# EAGLE design TLC591x-Interface-Board (EAGLE 9.0.0)
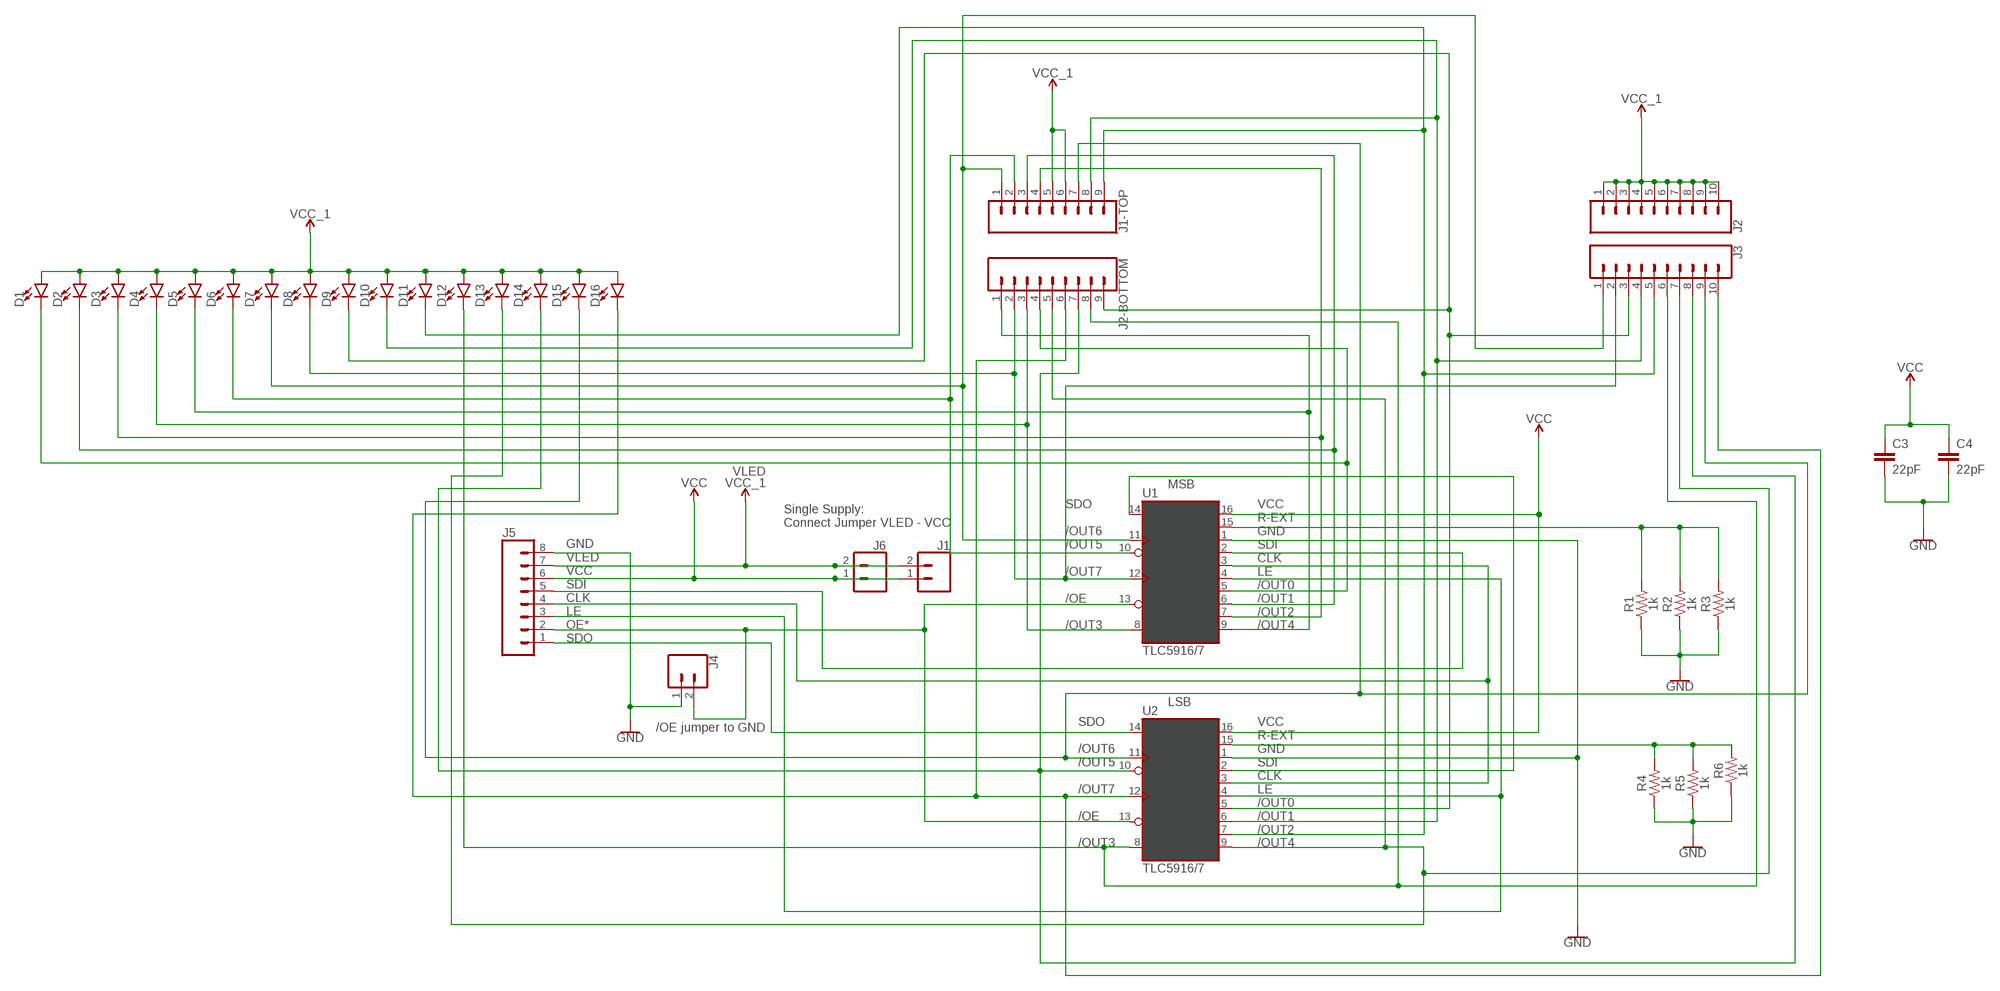
[diagram p0: schematic, sheet 1]

## Parts
C3  22pF  22PF-PTH-2.54MM-200V-5%  [CAP-PTH-2.54]
C4  22pF  22PF-PTH-2.54MM-200V-5%  [CAP-PTH-2.54]
D1  LED3MM  [LED_3MM]
D2  LED3MM  [LED_3MM]
D3  LED3MM  [LED_3MM]
D4  LED3MM  [LED_3MM]
D5  LED3MM  [LED_3MM]
D6  LED3MM  [LED_3MM]
D7  LED3MM  [LED_3MM]
D8  LED3MM  [LED_3MM]
D9  LED3MM  [LED_3MM]
D10  LED3MM  [LED_3MM]
D11  LED3MM  [LED_3MM]
D12  LED3MM  [LED_3MM]
D13  LED3MM  [LED_3MM]
D14  LED3MM  [LED_3MM]
D15  LED3MM  [LED_3MM]
D16  LED3MM  [LED_3MM]
J1  CONN_02  [1X02]
J1-TOP  CONN_09  [1X09]
J2  CONN_10LOCK  [1X10_LOCK]
J2-BOTTOM  CONN_09  [1X09]
J3  CONN_10LOCK  [1X10_LOCK]
J4  CONN_02  [1X02]
J5  CONN_08LOCK  [1X08_LOCK]
J6  CONN_02  [1X02]
R1  1k  1KOHM-HORIZ-1/4W-1%  [AXIAL-0.3]
R2  1k  1KOHM-HORIZ-1/4W-1%  [AXIAL-0.3]
R3  1k  1KOHM-HORIZ-1/4W-1%  [AXIAL-0.3]
R4  1k  1KOHM-HORIZ-1/4W-1%  [AXIAL-0.3]
R5  1k  1KOHM-HORIZ-1/4W-1%  [AXIAL-0.3]
R6  1k  1KOHM-HORIZ-1/4W-1%  [AXIAL-0.3]
U1  TLC5916/7  74HC595N  [DIP16]
U2  TLC5916/7  74HC595N  [DIP16]

## Nets
GND: C3.2 C4.2 J4.1 J5.8 R1.P$1 R2.P$1 R3.P$1 R4.P$1 R5.P$1 R6.P$1 U1.1(QB) U2.1(QB)
N$1: J4.2 J5.2 U1.13(G) U2.13(G)
N$2: J5.1 U2.14(SER)
N$3: D15.K(C) J1-TOP.7 J3.9 U2.11(SCK)
N$5: D7.K(C) J1-TOP.1 J3.1 U1.11(SCK)
N$6: D6.K(C) J1-TOP.2 U1.10(SCL)
N$7: D5.K(C) J2-BOTTOM.1 U1.9(QH*)
N$8: D4.K(C) J2-BOTTOM.3 U1.8(GND)
N$9: D3.K(C) J1-TOP.4 U1.7(QH)
N$10: D2.K(C) J1-TOP.3 U1.6(QG)
N$11: D1.K(C) J2-BOTTOM.4 U1.5(QF)
N$12: D16.K(C) J2-BOTTOM.6 J3.10 U2.12(RCK)
N$13: D14.K(C) J2-BOTTOM.7 J3.8 U2.10(SCL)
N$14: D13.K(C) J2-BOTTOM.5 J3.7 U2.9(QH*)
N$15: D12.K(C) J2-BOTTOM.8 J3.6 U2.8(GND)
N$16: D11.K(C) J1-TOP.9 J3.5 U2.7(QH)
N$17: D10.K(C) J1-TOP.8 J3.4 U2.6(QG)
N$18: D9.K(C) J2-BOTTOM.9 J3.3 U2.5(QF)
N$19: R1.P$2 R2.P$2 R3.P$2 U1.15(QA)
N$20: U1.14(SER) U2.2(QC)
N$21: R4.P$2 R5.P$2 R6.P$2 U2.15(QA)
N$22: J5.5 U1.2(QC)
N$24: J5.4 U1.3(QD) U2.3(QD)
N$25: J5.3 U1.4(QE) U2.4(QE)
N$26: D8.K(C) J2-BOTTOM.2 J3.2 U1.12(RCK)
VCC: C3.1 C4.1 J1.1 J5.6 J6.1 U1.16(VCC) U2.16(VCC)
VCC_1: D1.A D2.A D3.A D4.A D5.A D6.A D7.A D8.A D9.A D10.A D11.A D12.A D13.A D14.A D15.A D16.A J1-TOP.5 J1-TOP.6 J1.2 J2.1 J2.2 J2.3 J2.4 J2.5 J2.6 J2.7 J2.8 J2.9 J2.10 J5.7 J6.2

## Notes on the sheet
- VLED
- MSB
- Single Supply: 
  Connect Jumper VLED - VCC
- SDO
  
  /OUT6
  /OUT5
  
  /OUT7
  
  /OE
  
  /OUT3
- VCC
  R-EXT
  GND
  SDI
  CLK
  LE
  /OUT0
  /OUT1
  /OUT2
  /OUT4
- GND
  VLED
  VCC
  SDI
  CLK
  LE
  OE*
  SDO
- LSB
- /OE jumper to GND
- SDO
  
  /OUT6
  /OUT5
  
  /OUT7
  
  /OE
  
  /OUT3
- VCC
  R-EXT
  GND
  SDI
  CLK
  LE
  /OUT0
  /OUT1
  /OUT2
  /OUT4

## Library data of the parts
C3 C4 = SparkFun-Capacitors:22PF: 22pF ceramic capacitors A capacitor is a passive two-terminal electrical component used to store electrical energy temporarily in an electric field.; PROD_ID: CAP-09128
D1-D16 = SparkFun-LED:LED: LED (Generic) Standard schematic elements and footprints for 5mm, 3mm, 1206, and 0603 sized LEDs. Generic LEDs with no color specified.; PROD_ID: DIO-08794
J1 J4 J6 = SparkFun-Connectors:CONN_02: Multi connection point. Often used as Generic Header-pin footprint for 0.1 inch spaced/style header connections On any of the 0.1 inch spaced packages, you can populate with these: Break Away Headers - Straight <https://www.sparkfun.com/products/116> (PRT-00116) Break Away Male Headers - Right Angle <https://www.sparkfun.com/products/553> (PRT-00553) Female Headers <https://www.sparkfun.com/products/115> (PRT-00115) Break Away Headers - Machine Pin <https://www.sparkfun.com/products/117> (PRT-00117) Break Away Female Headers - Swiss Machine Pin <https://www.sparkfun.com/products/743> (PRT-00743) For SCREWTERMINALS and SPRING TERMINALS visit here: Screw Terimnals on SparkFun.com <https://www.sparkfun.com/search/results?term=Screw+Terminals> (5mm/3.5mm/2.54mm spacing) This device is also useful as a general connection point to wire up your design to another part of your project. Our various solder wires solder well into these plated through hole pads. Hook-Up Wire - Assortment (Stranded, 22 AWG) <https://www.sparkfun.com/products/11375> (PRT-11375) Hook-Up Wire - Assortment (Solid Core, 22 AWG) <https://www.sparkfun.com/products/11367> (PRT-11367) View the entire wire category on our website here <https://www.sparkfun.com/categories/141> Special notes: Molex polarized connector foot print use with: PRT-08233 with associated crimp pins and housings. 2.54_SCREWTERM for use with PRT-10571. 3.5mm Screw Terminal footprints for PRT-08084 5mm Screw Terminal footprints for use with PRT-08432
J1-TOP J2-BOTTOM = SparkFun-Connectors:CONN_09: Multi connection point. Often used as Generic Header-pin footprint for 0.1 inch spaced/style header connections On any of the 0.1 inch spaced packages, you can populate with these: Break Away Headers - Straight <https://www.sparkfun.com/products/116> (PRT-00116) Break Away Male Headers - Right Angle <https://www.sparkfun.com/products/553> (PRT-00553) Female Headers <https://www.sparkfun.com/products/115> (PRT-00115) Break Away Headers - Machine Pin <https://www.sparkfun.com/products/117> (PRT-00117) Break Away Female Headers - Swiss Machine Pin <https://www.sparkfun.com/products/743> (PRT-00743) For SCREWTERMINALS and SPRING TERMINALS visit here: Screw Terimnals on SparkFun.com <https://www.sparkfun.com/search/results?term=Screw+Terminals> (5mm/3.5mm/2.54mm spacing) This device is also useful as a general connection point to wire up your design to another part of your project. Our various solder wires solder well into these plated through hole pads. Hook-Up Wire - Assortment (Stranded, 22 AWG) <https://www.sparkfun.com/products/11375> (PRT-11375) Hook-Up Wire - Assortment (Solid Core, 22 AWG) <https://www.sparkfun.com/products/11367> (PRT-11367) View the entire wire category on our website here <https://www.sparkfun.com/categories/141> Special notes: Molex polarized connector foot print use with SKU : PRT-08231 with associated crimp pins and housings. 1MM SMD Version SKU: PRT-10208 NOTES ON THE VARIANTS LOCK and LOCK_LONGPADS... This footprint was designed to help hold the alignment of a through-hole component (i.e. 6-pin header) while soldering it into place. You may notice that each hole has been shifted either up or down by 0.005 of an inch from it's more standard position (which is a perfectly straight line). This slight alteration caused the pins (the squares in the middle) to touch the edges of the holes. Because they are alternating, it causes a "brace" to hold the component in place. 0.005 has proven to be the perfect amount of "off-center" position when using our standard breakaway headers. Although looks a little odd when you look at the bare footprint, once you have a header in there, the alteration is very hard to notice. Also,if you push a header all the way into place, it is covered up entirely on the bottom side.
J2 J3 = SparkFun-Connectors:CONN_10: Multi connection point. Often used as Generic Header-pin footprint for 0.1 inch spaced/style header connections On any of the 0.1 inch spaced packages, you can populate with these: Break Away Headers - Straight <https://www.sparkfun.com/products/116> (PRT-00116) Break Away Male Headers - Right Angle <https://www.sparkfun.com/products/553> (PRT-00553) Female Headers <https://www.sparkfun.com/products/115> (PRT-00115) Break Away Headers - Machine Pin <https://www.sparkfun.com/products/117> (PRT-00117) Break Away Female Headers - Swiss Machine Pin <https://www.sparkfun.com/products/743> (PRT-00743) Arduino Stackable Header - 10 Pin <https://www.sparkfun.com/products/11376> (PRT-11376) For SCREWTERMINALS and SPRING TERMINALS visit here: Screw Terimnals on SparkFun.com <https://www.sparkfun.com/search/results?term=Screw+Terminals> (5mm/3.5mm/2.54mm spacing) This device is also useful as a general connection point to wire up your design to another part of your project. Our various solder wires solder well into these plated through hole pads. Hook-Up Wire - Assortment (Stranded, 22 AWG) <https://www.sparkfun.com/products/11375> (PRT-11375) Hook-Up Wire - Assortment (Solid Core, 22 AWG) <https://www.sparkfun.com/products/11367> (PRT-11367) View the entire wire category on our website here <https://www.sparkfun.com/categories/141> Special notes: Molex polarized connector foot print use with SKU : PRT-08231 with associated crimp pins and housings. 1MM SMD Version SKU: PRT-10208 NOTES ON THE VARIANTS LOCK and LOCK_LONGPADS... This footprint was designed to help hold the alignment of a through-hole component (i.e. 6-pin header) while soldering it into place. You may notice that each hole has been shifted either up or down by 0.005 of an inch from it's more standard position (which is a perfectly straight line). This slight alteration caused the pins (the squares in the middle) to touch the edges of the holes. Because they are alternating, it causes a "brace" to hold the component in place. 0.005 has proven to be the perfect amount of "off-center" position when using our standard breakaway headers. Although looks a little odd when you look at the bare footprint, once you have a header in there, the alteration is very hard to notice. Also,if you push a header all the way into place, it is covered up entirely on the bottom side.
J5 = SparkFun-Connectors:CONN_08: Multi connection point. Often used as Generic Header-pin footprint for 0.1 inch spaced/style header connections On any of the 0.1 inch spaced packages, you can populate with these: Break Away Headers - Straight <https://www.sparkfun.com/products/116> (PRT-00116) Break Away Male Headers - Right Angle <https://www.sparkfun.com/products/553> (PRT-00553) Female Headers <https://www.sparkfun.com/products/115> (PRT-00115) Break Away Headers - Machine Pin <https://www.sparkfun.com/products/117> (PRT-00117) Break Away Female Headers - Swiss Machine Pin <https://www.sparkfun.com/products/743> (PRT-00743) Arduino Stackable Header - 8 Pin <https://www.sparkfun.com/products/9279> (PRT-09279) For SCREWTERMINALS and SPRING TERMINALS visit here: Screw Terimnals on SparkFun.com <https://www.sparkfun.com/search/results?term=Screw+Terminals> (5mm/3.5mm/2.54mm spacing) This device is also useful as a general connection point to wire up your design to another part of your project. Our various solder wires solder well into these plated through hole pads. Hook-Up Wire - Assortment (Stranded, 22 AWG) <https://www.sparkfun.com/products/11375> (PRT-11375) Hook-Up Wire - Assortment (Solid Core, 22 AWG) <https://www.sparkfun.com/products/11367> (PRT-11367) View the entire wire category on our website here <https://www.sparkfun.com/categories/141> Special notes: Molex polarized connector foot print use with SKU : PRT-08231 with associated crimp pins and housings. 1MM SMD Version SKU: PRT-10208 NOTES ON THE VARIANTS LOCK and LOCK_LONGPADS... This footprint was designed to help hold the alignment of a through-hole component (i.e. 6-pin header) while soldering it into place. You may notice that each hole has been shifted either up or down by 0.005 of an inch from it's more standard position (which is a perfectly straight line). This slight alteration caused the pins (the squares in the middle) to touch the edges of the holes. Because they are alternating, it causes a "brace" to hold the component in place. 0.005 has proven to be the perfect amount of "off-center" position when using our standard breakaway headers. Although looks a little odd when you look at the bare footprint, once you have a header in there, the alteration is very hard to notice. Also,if you push a header all the way into place, it is covered up entirely on the bottom side.
R1-R6 = SparkFun-Resistors:1KOHM: 1kΩ resistor A resistor is a passive two-terminal electrical component that implements electrical resistance as a circuit element. Resistors act to reduce current flow, and, at the same time, act to lower voltage levels within circuits. - Wikipedia; PROD_ID: RES-12182
U1 U2 = SparkFun-IC-Logic:74*595: 8-Bit Shift Register (Serial to Parallel) Datasheet <http://cdn.sparkfun.com/datasheets/BreakoutBoards/MM74HC595.pdf> SparkFun Products SparkFun Shift Register Breakout - 74HC595 <https://www.sparkfun.com/products/10680> (BOB-10680); PROD_ID: IC-13123; VALUE: SN74HC595N

## Board
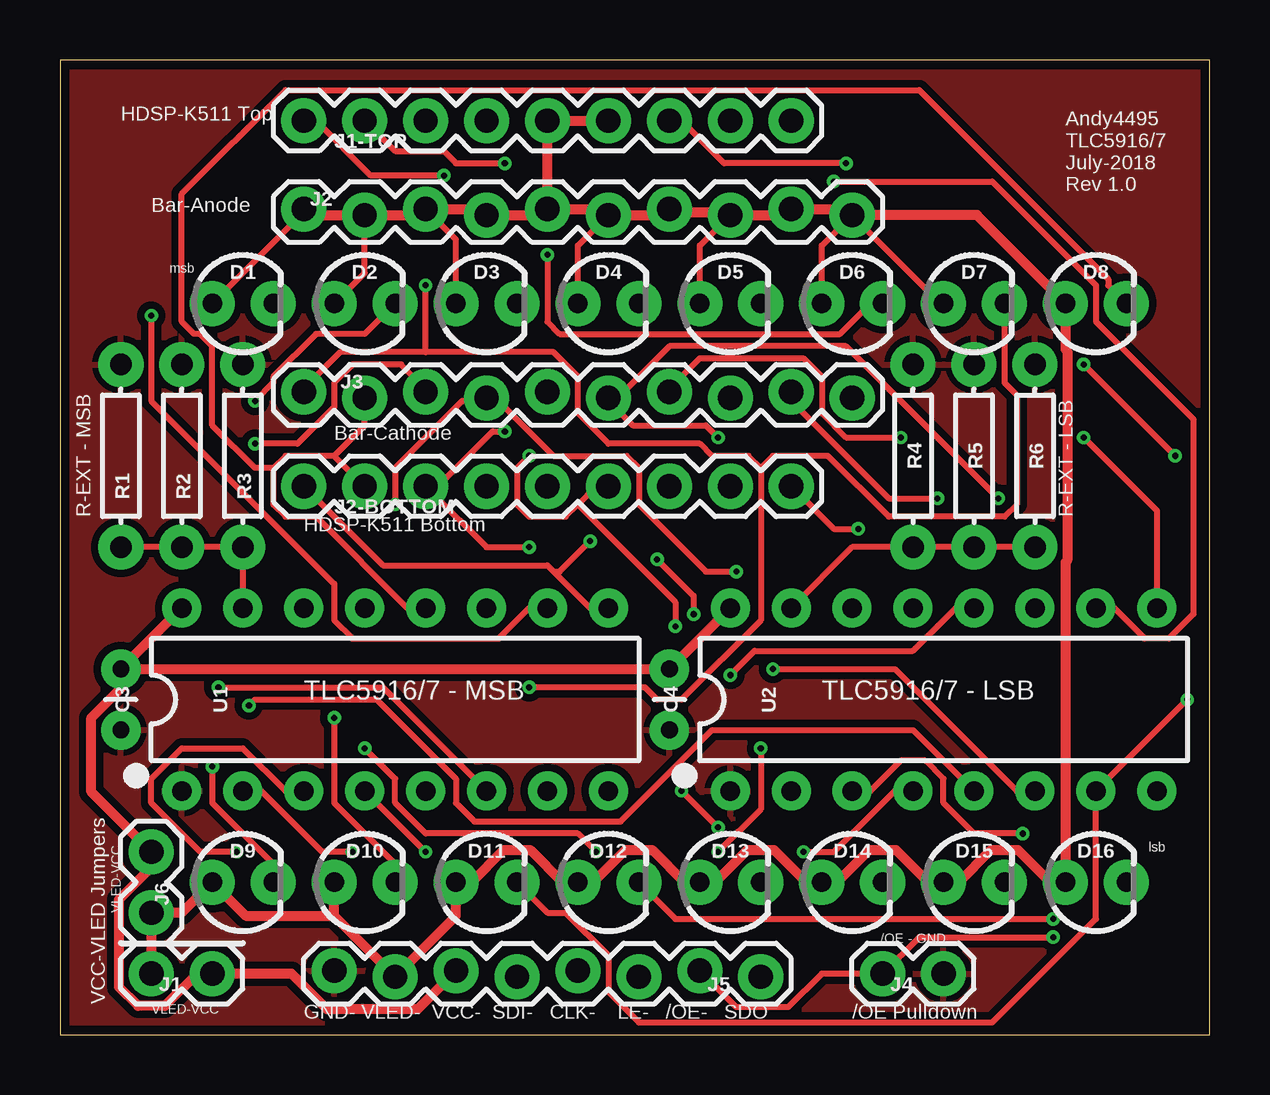
[diagram p1: board, top side]
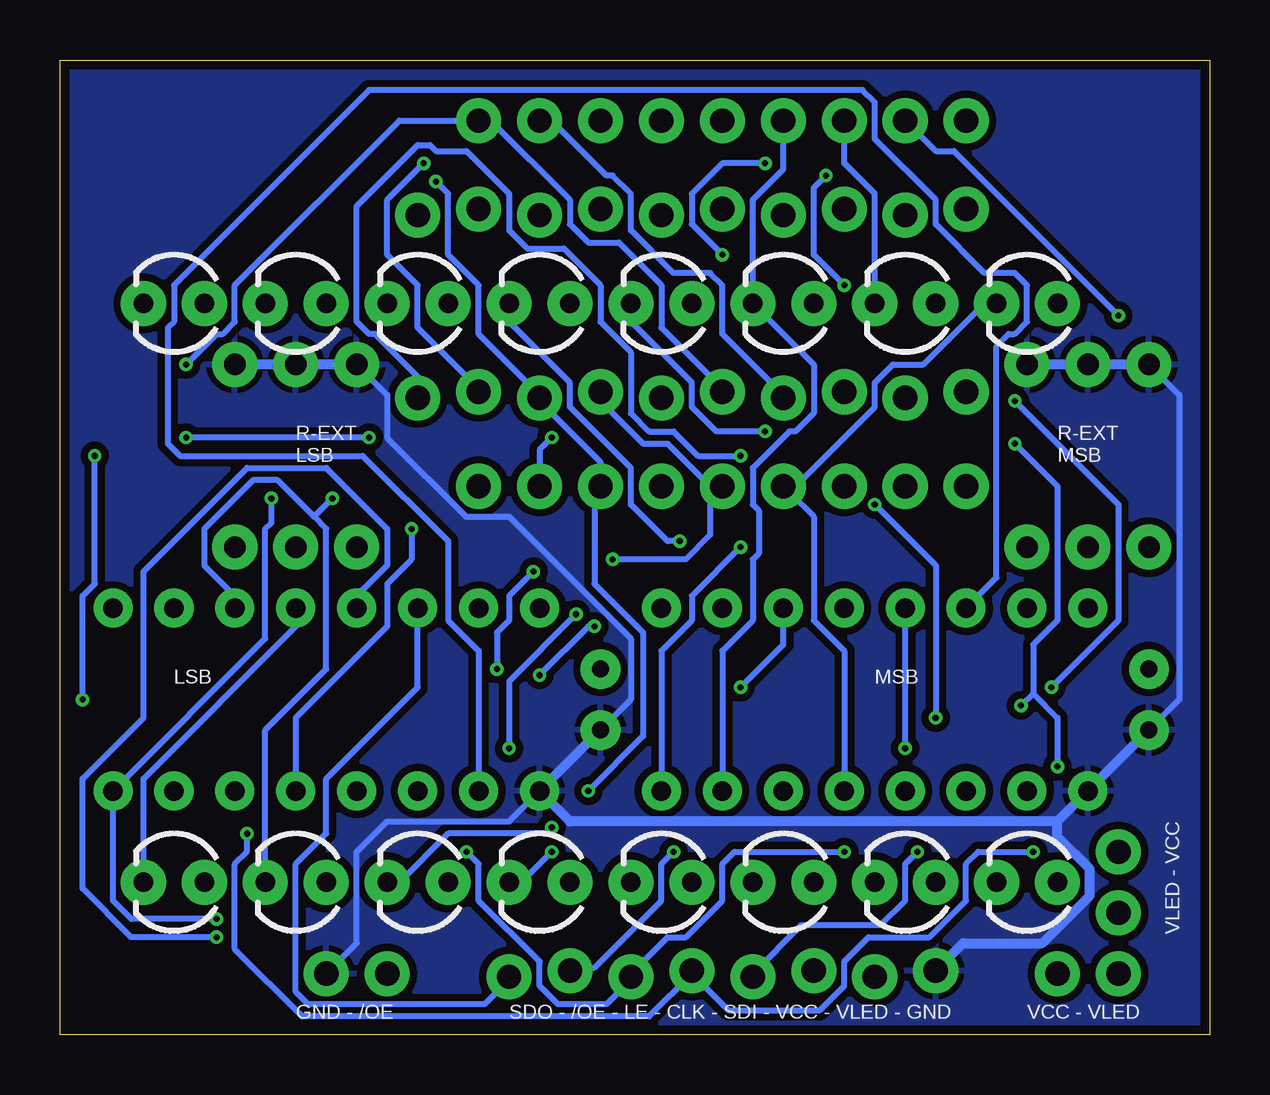
[diagram p2: board, bottom side, seen from below]

Size 47.93 x 40.63 mm. Coordinates in mm from the lower left corner, seen from the top.
Outline: 0,0 47.93,0 47.93,40.63 0,40.63 0,0
Copper layers (1*16): Top 0.035559375mm / dielectric 1.6mm / Bottom 0.035559375mm
Design rules "oshpark-2layer-auto-routing": minimum track width 10mil, minimum drill 10mil, track to track 10mil, track to pad 8mil, pad to pad 8mil, via to via 8mil, smd to smd 6mil, copper to edge 15mil, drill to drill 6mil, minimum pad ring 6mil, minimum via ring 6mil, stop-mask expansion 2.5mil, vias tented up to drill 0mil, thermal gap 10mil

### Footprints (pad centres in the part's own frame; a part is rotated, then mirrored left to right if it is on the bottom)
CAP-PTH-2.54 = drill 0.7 pad 1.651: 1 -1.27,0; 2 1.27,0
LED_3MM = drill 0.813 pad 1.88: A -1.27,0; K 1.27,0
1X02 = drill 1.016 pad 1.88: 1 0,0; 2 2.54,0
1X09 = drill 1.016 pad 1.88: 1 0,0; 2 2.54,0; 3 5.08,0; 4 7.62,0; 5 10.16,0; 6 12.7,0; 7 15.24,0; 8 17.78,0; 9 20.32,0
1X10_LOCK = drill 1.016 pad 1.88: 1 0,0.127; 2 2.54,-0.127; 3 5.08,0.127; 4 7.62,-0.127; 5 10.16,0.127; 6 12.7,-0.127; 7 15.24,0.127; 8 17.78,-0.127; 9 20.32,0.127; 10 22.86,-0.127
1X08_LOCK = drill 1.016 pad 1.88: 1 0,0.127; 2 2.54,-0.127; 3 5.08,0.127; 4 7.62,-0.127; 5 10.16,0.127; 6 12.7,-0.127; 7 15.24,0.127; 8 17.78,-0.127
AXIAL-0.3 = drill 0.9 pad 1.88: P$1 -3.81,0; P$2 3.81,0
DIP16 = drill 0.813 pad 1.626: 1 -8.89,-3.81; 2 -6.35,-3.81; 3 -3.81,-3.81; 4 -1.27,-3.81; 5 1.27,-3.81; 6 3.81,-3.81; 7 6.35,-3.81; 8 8.89,-3.81; 9 8.89,3.81; 10 6.35,3.81; 11 3.81,3.81; 12 1.27,3.81; 13 -1.27,3.81; 14 -3.81,3.81; 15 -6.35,3.81; 16 -8.89,3.81

### Placement (x,y rotation side)
C3  2.54,13.97 270 top
C4  25.4,13.97 270 top
D1  7.62,30.48 0 top
D2  12.7,30.48 0 top
D3  17.78,30.48 0 top
D4  22.86,30.48 0 top
D5  27.94,30.48 0 top
D6  33.02,30.48 0 top
D7  38.1,30.48 0 top
D8  43.18,30.48 0 top
D9  7.62,6.35 0 top
D10  12.7,6.35 0 top
D11  17.78,6.35 0 top
D12  22.86,6.35 0 top
D13  27.94,6.35 0 top
D14  33.02,6.35 0 top
D15  38.1,6.35 0 top
D16  43.18,6.35 0 top
J1  6.35,2.54 180 top
J1-TOP  10.16,38.1 0 top
J2  10.16,34.29 0 top
J2-BOTTOM  10.16,22.86 0 top
J3  10.16,26.67 0 top
J4  36.83,2.54 180 top
J5  29.21,2.54 180 top
J6  3.81,7.62 270 top
R1  2.54,24.13 270 top
R2  5.08,24.13 270 top
R3  7.62,24.13 270 top
R4  35.56,24.13 270 top
R5  38.1,24.13 270 top
R6  40.64,24.13 270 top
U1  13.97,13.97 0 top
U2  36.83,13.97 0 top

### Tracks (layer width: path | path; a pad name or v marks a point on that pad's centre or on a via)
GND
  Bottom 0.254: R1.P$1 1.27,26.67 1.27,13.97 C3.2 | R4.P$1 34.29,26.67 34.29,24.87 31.01,21.59 29.21,21.59 24.13,16.51 24.13,13.97 C4.2 | J4.1 35.56,3.81 35.56,7.62 34.29,8.89 29.21,8.89 U2.1
  Bottom 0.406: C3.2 U1.1 6.35,8.89 | C4.2 U2.1 26.67,8.89 6.35,8.89 | R1.P$1 R2.P$1 R3.P$1 | R4.P$1 R5.P$1 R6.P$1 | J5.8 10.29,3.81 6.99,3.81 5,5.79 5,6.91 6.35,8.25 6.35,8.89
  pour Bottom (isolate 0.305): 0,40.64 48.26,40.64 48.26,0 0,0
  pour Top (isolate 0.305): 0,40.64 48.26,40.64 48.26,0 0,0
N$1  (via drill 0.25)
  Top 0.254: J5.2 28.19,1.14 30.35,1.14 31.75,2.54 J4.2 35.81,4.06 v41.4,4.06 | v12.7,11.94 13.97,10.67 13.97,9.65 15.24,8.38 21.59,8.38 v22.35,7.62
  Bottom 0.254: v12.7,11.94 U1.13 | v22.35,7.62 22.86,7.11 22.86,5.59 25.65,2.79 26.67,2.79 J5.2 | U2.13 35.56,18.29 34.29,19.56 34.29,21.08 36.83,23.62 40.13,23.62 44.45,19.3 44.45,13.21 46.99,10.67 46.99,6.1 44.96,4.06 v41.4,4.06
N$2
  Bottom 0.254: U2.14 33.02,14.48 36.83,10.67 36.83,8.38 38.1,7.11 38.1,1.78 37.59,1.27 30.23,1.27 29.21,2.29 J5.1
N$3  (via drill 0.25)
  Top 0.254: J1-TOP.7 25.91,38.1 27.69,36.32 v32.77,36.32 | v36.58,22.35 34.54,22.35 30.48,26.42 J3.9
  Bottom 0.254: U2.11 40.64,18.29 41.91,19.56 41.91,21.08 39.88,23.11 38.86,23.11 37.34,21.59 | 37.34,21.59 36.83,21.08 36.83,15.24 39.37,12.7 D15.K | v32.77,36.32 34.29,34.8 34.29,32.51 33.02,31.24 33.02,29.46 30.48,26.92 J3.9 | v36.58,22.35 37.34,21.59
N$5  (via drill 0.25)
  Top 0.254: v19.56,14.48 24.38,14.48 24.89,13.97 25.91,13.97 29.21,17.27 29.21,23.62 | 29.21,23.62 29.72,24.13 32,24.13 34.54,21.59 39.37,21.59 39.88,22.1 39.88,26.67 39.37,27.18 D7.K | 15.24,28.45 20.57,28.45 21.59,27.43 21.59,25.91 22.86,24.64 26.67,24.64 27.18,24.13 28.7,24.13 29.21,23.62 | 15.24,28.45 11.68,28.45 10.16,26.92 J3.1 | J1-TOP.1 10.67,38.1 12.95,35.81 v16,35.81 | 15.24,28.45 v15.24,31.24
  Bottom 0.254: U1.11 17.78,16.26 v19.56,14.48 | v16,35.81 16.51,35.31 16.51,32.51 v15.24,31.24
N$6  (via drill 0.25)
  Top 0.254: U1.10 19.56,17.78 18.29,16.51 12.19,16.51 11.43,17.27 11.43,18.8 3.81,26.42 v3.81,29.97 | D6.K 33.78,30.48 32.51,29.21 20.83,29.21 20.32,29.72 v20.32,32.51 | v18.54,36.32 16.51,36.32 16,36.83 13.97,36.83 J1-TOP.2
  Bottom 0.254: v3.81,29.97 10.67,36.83 11.43,36.83 J1-TOP.2 | v20.32,32.51 21.59,33.78 21.59,35.05 20.32,36.32 v18.54,36.32
N$7  (via drill 0.25)
  Top 0.254: U1.9 22.1,17.78 20.57,19.3 | 20.57,19.3 20.32,19.56 13.46,19.56 J2-BOTTOM.1 | v22.1,20.57 20.83,19.3 20.57,19.3
  Bottom 0.254: D5.K 29.21,29.72 26.67,27.18 26.67,26.16 24.13,23.62 24.13,22.1 22.61,20.57 v22.1,20.57
N$8  (via drill 0.25)
  Top 0.254: v19.56,20.32 17.78,20.32 15.49,22.61 | v18.54,25.15 18.03,25.15 15.49,22.61 | 15.49,22.61 J2-BOTTOM.3
  Bottom 0.254: U1.8 22.86,16 21.59,17.27 21.59,18.29 v19.56,20.32 | D4.K 24.13,29.72 21.59,27.18 21.59,26.16 20.57,25.15 v18.54,25.15
N$9
  Bottom 0.254: U1.7 20.32,16 19.05,17.27 19.05,19.81 18.8,20.07 18.8,21.84 19.05,22.1 19.05,23.62 17.53,25.15 17.27,25.15 16.51,25.91 16.51,27.94 D3.K 19.05,34.8 17.78,36.07 J1-TOP.4
N$10  (via drill 0.25)
  Top 0.254: U1.6 13.46,14.48 v6.6,14.48 | v8.13,26.42 8.89,27.18 8.89,27.43 10.67,29.21 12.7,29.21 D2.K
  Bottom 0.254: v6.6,14.48 3.81,17.27 3.81,22.1 v8.13,26.42 | J1-TOP.3 15.24,36.32 13.97,35.05 D2.K
N$11
  Bottom 0.254: U1.5 15.24,16 16.51,17.27 16.51,21.59 17.53,22.61 | D1.K 9.4,30.48 11.94,27.94 13.21,27.94 13.97,27.18 13.97,26.16 17.53,22.61 | 17.53,22.61 J2-BOTTOM.4
N$12  (via drill 0.25)
  Top 0.254: J2-BOTTOM.6 22.35,22.86 21.59,22.1 | 21.59,22.1 21.08,21.59 19.56,21.59 19.05,22.1 19.05,23.62 v19.56,24.13 | U2.12 37.34,17.78 35.56,16 28.96,16 v27.94,14.99 | v25.65,17.02 25.65,18.03 21.59,22.1
  Bottom 0.254: U2.12 38.1,17.02 44.45,10.67 D16.K | v19.56,24.13 21.34,24.13 22.35,25.15 23.37,25.15 24.13,25.91 24.13,28.45 25.4,29.72 25.4,31.24 26.92,32.77 28.45,32.77 29.21,33.53 29.21,35.05 30.99,36.83 32.26,36.83 32.51,37.08 33.02,37.08 35.56,34.54 35.56,29.72 35.05,29.21 34.8,29.21 33.02,27.43 J3.10 | v27.94,14.99 25.91,17.02 v25.65,17.02
N$13  (via drill 0.25)
  Top 0.254: U2.10 43.94,17.78 45.21,16.51 46.23,16.51 47.24,17.53 47.24,25.65 43.18,29.72 43.18,31.24 38.86,35.56 v32.26,35.56 | v25.91,10.16 v27.43,8.64
  Bottom 0.254: v32.26,35.56 31.75,35.05 31.75,32.51 30.48,31.24 30.48,29.21 27.94,26.67 J3.8 27.94,26.42 25.4,23.88 J2-BOTTOM.7 25.65,22.61 25.65,18.8 23.62,16.76 23.62,12.45 v25.91,10.16 | D14.K 33.78,6.35 31.75,8.38 27.69,8.38 v27.43,8.64
N$14  (via drill 0.25)
  Top 0.254: U2.9 45.72,21.84 v42.67,24.89 | v35.05,24.89 32.77,24.89 31.75,25.91 31.75,27.43 30.99,28.19 26.67,28.19 25.4,26.92 J3.7 | v27.43,7.62 29.21,9.4 v29.21,11.94 | v26.42,17.53 26.42,18.29 v24.89,19.81
  Bottom 0.254: v35.05,24.89 v42.67,24.89 | 20.83,22.86 22.61,24.64 23.62,24.64 25.4,26.42 J3.7 | D13.K 28.7,6.35 v27.43,7.62 | v29.21,11.94 29.21,14.73 v26.42,17.53 | v24.89,19.81 21.84,19.81 20.83,20.83 20.83,22.86 | 20.83,22.86 J2-BOTTOM.5
N$15  (via drill 0.25)
  Top 0.254: v27.43,24.89 26.92,25.4 23.88,25.4 22.86,26.42 J3.6 22.86,26.67 23.37,26.67 25.4,28.7 32.77,28.7 v39.12,22.35 | v41.4,4.83 25.65,4.83 D12.K
  Bottom 0.254: J2-BOTTOM.8 27.94,24.38 v27.43,24.89 | v41.4,4.83 44.96,4.83 45.72,5.59 U2.8 39.37,16.51 39.37,21.08 39.12,21.34 v39.12,22.35
N$16  (via drill 0.25)
  Top 0.254: D11.K 20.32,5.08 21.08,5.08 22.86,3.3 22.86,1.78 24.13,0.51 38.86,0.51 43.18,4.83 U2.7 v46.99,13.97 | v46.48,24.13 v42.67,27.94
  Bottom 0.254: J3.5 20.32,26.92 22.86,29.46 22.86,31.24 24.64,33.02 25.91,33.02 26.67,33.78 26.67,34.8 29.97,38.1 J1-TOP.9 33.78,38.1 40.64,31.24 40.64,29.72 41.15,29.21 41.4,29.21 v42.67,27.94 | v46.48,24.13 46.48,18.8 46.99,18.29 v46.99,13.97
N$17  (via drill 0.25)
  Top 0.254: U2.6 39.88,10.16 34.8,15.24 v29.72,15.24 | v28.19,19.3 26.92,19.3 24.13,22.1 24.13,23.62 23.62,24.13 20.57,24.13 18.29,26.42 17.78,26.42 | D10.K 13.97,7.11 11.43,9.65 v11.43,13.21 | v13.97,22.1 13.97,23.62 16.76,26.42 17.78,26.42 | 17.78,26.42 J3.4
  Bottom 0.254: v29.72,15.24 29.72,16.76 29.21,17.27 29.21,18.29 v28.19,19.3 | v11.43,13.21 11.43,19.56 v13.97,22.1 | J1-TOP.8 27.43,38.1 25.15,35.81 24.89,35.81 24.13,35.05 24.13,33.53 22.35,31.75 20.83,31.75 20.32,31.24 20.32,29.21 17.78,26.67 J3.4
N$18  (via drill 0.25)
  Top 0.254: v33.27,21.08 32.26,21.08 J2-BOTTOM.9 | D9.K 8.89,7.11 6.35,9.65 v6.35,11.18 | v8.13,24.64 9.91,24.64 11.43,26.16 11.43,27.18 12.19,27.94 14.22,27.94 15.24,26.92 J3.3 | U2.5 35.56,12.7 27.18,12.7 23.37,8.89 17.27,8.89 16.51,9.65 16.51,10.67 13.21,13.97 8.13,13.97 v7.87,13.72
  Bottom 0.254: U2.5 38.1,13.21 34.29,17.02 34.29,18.8 33.27,19.81 v33.27,21.08 | v6.35,11.18 6.35,13.21 7.37,14.22 | 7.37,14.22 7.37,16.26 6.35,17.27 6.35,22.86 v8.13,24.64 | 7.37,14.22 v7.87,13.72
N$19
  Top 0.254: R1.P$2 R2.P$2 R3.P$2 U1.15
N$20
  Bottom 0.254: U2.2 30.48,16 31.75,17.27 31.75,20.57 35.31,24.13 42.93,24.13 43.43,24.64 43.43,29.46 43.18,29.72 43.18,31.24 35.05,39.37 14.48,39.37 13.97,38.86 13.97,37.34 11.43,34.8 11.43,33.78 9.4,31.75 8.13,31.75 7.62,31.24 7.62,29.72 8.13,29.21 8.38,29.21 8.89,28.7 8.89,19.05 U1.14
N$21
  Top 0.254: R6.P$2 R5.P$2 R4.P$2 33.02,20.32 U2.15
N$22  (via drill 0.25)
  Top 0.254: U1.2 8.38,10.16 10.92,7.62 v12.19,7.62
  Bottom 0.254: v12.19,7.62 12.7,7.11 12.7,5.59 13.72,4.57 17.02,4.57 19.05,2.54 J5.5
N$24  (via drill 0.25)
  Top 0.254: U1.3 9.4,10.16 7.62,11.94 5.08,11.94 3.81,10.67 3.81,9.65 5.84,7.62 v7.37,7.62 | U2.3 33.78,10.16 35.05,11.43 36.07,11.43 36.83,10.67 36.83,9.65 38.1,8.38 v40.13,8.38
  Bottom 0.254: v7.37,7.62 9.65,7.62 10.16,7.11 10.16,5.59 11.68,4.06 14.22,4.06 15.24,3.05 15.24,2.03 16.26,1.02 20.07,1.02 21.59,2.54 | v40.13,8.38 40.13,7.62 40.64,7.11 40.64,3.56 37.85,0.76 23.37,0.76 21.59,2.54 | 21.59,2.54 J5.4
N$25  (via drill 0.25)
  Top 0.254: v15.24,7.62 U1.4 | U2.4 34.8,10.16 32.26,7.62 v30.99,7.62
  Bottom 0.254: v15.24,7.62 19.81,7.62 20.32,7.11 20.32,5.59 21.84,4.06 22.61,4.06 24.13,2.54 J5.3 24.13,2.29 25.15,1.27 27.18,1.27 27.94,2.03 27.94,3.05 30.48,5.59 30.48,7.11 v30.99,7.62
N$26
  Top 0.254: U1.12 14.48,17.78 10.67,21.59 9.4,21.59 8.89,22.1 8.89,23.62 | 8.89,23.62 9.4,24.13 11.43,24.13 | J2-BOTTOM.2 11.43,24.13 | J3.2 12.7,25.4 11.43,24.13 | D8.K 43.69,31.24 43.69,31.5 35.81,39.37 9.4,39.37 5.08,35.05 5.08,29.72 5.59,29.21 5.84,29.21 6.35,28.7 6.35,25.4 8.13,23.62 8.89,23.62
VCC
  Top 0.406: U1.16 C3.1 | U2.16 C4.1 C3.1 | J5.6 14.91,1.07 11.13,1.07 9.65,2.54 J1.1 5.71,2.54 4.37,1.19 3.25,1.19 2.46,1.98 2.46,5.64 3.81,6.98 J6.1 1.31,10.12 1.31,13.21 2.54,14.44 C3.1
VCC_1
  Top 0.254: D1.A 10.16,34.29 J2.1 | D2.A 12.7,31.75 J2.2 | D3.A 16.51,33.15 J2.3 | D4.A 21.59,32.89 J2.6 | D5.A 26.67,32.89 J2.8 | D6.A 31.75,32.89 J2.10 36.7,30.48 D7.A | 25.4,34.29 J2.7
  Top 0.406: J2.1 10.41,34.16 J2.2 14.99,34.16 J2.3 17.53,34.42 J2.4 20.07,34.16 J2.5 | J2.5 22.61,34.42 J2.6 25.27,34.16 25.4,34.29 27.81,34.29 J2.8 30.23,34.16 J2.9 32.77,34.42 J2.10 38.23,34.16 D8.A 41.91,28.57 41.99,28.5 41.99,19.76 41.91,19.69 D16.A 41.27,6.35 39.93,7.7 38.81,7.7 37.47,6.35 D15.A 36.19,6.35 34.85,7.7 33.73,7.7 32.39,6.35 D14.A 31.11,6.35 29.77,7.7 28.65,7.7 27.31,6.35 D13.A 26.03,6.35 24.69,7.7 23.57,7.7 22.23,6.35 D12.A 20.95,6.35 19.61,7.7 18.49,7.7 17.15,6.35 D11.A 16.51,4.95 J5.7 11.43,4.95 | J1.2 J6.2 5.08,5.08 D9.A 7.75,4.95 11.43,4.95 | 11.43,4.95 D10.A | J2.5 J1-TOP.5 J1-TOP.6

### Text on the board
tPlace: HDSP-K511 Top | Andy4495 / TLC5916/7 / July-2018 / Rev 1.0 | Bar-Anode | msb | Bar-Cathode | R-EXT - MSB | HDSP-K511 Bottom | R-EXT - LSB | TLC5916/7 - MSB | TLC5916/7 - LSB | lsb | VLED-VCC | /OE - GND | VCC-VLED Jumpers | VLED-VCC | GND- VLED- VCC- SDI- CLK- LE- /OE- SDO | /OE Pulldown
bPlace: R-EXT / MSB | R-EXT / LSB | MSB | LSB | VLED - VCC | VCC - VLED | SDO - /OE - LE - CLK - SDI - VCC - VLED - GND | GND - /OE